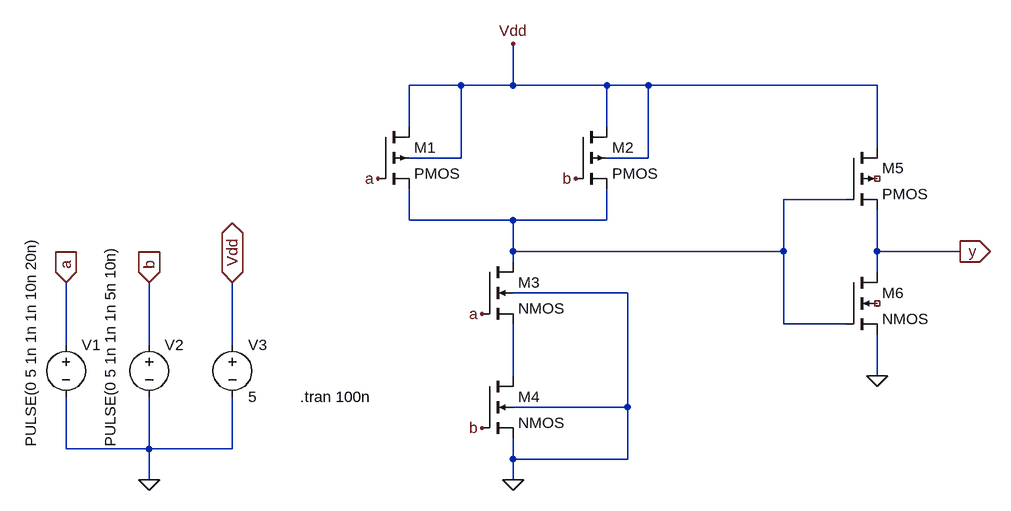
[diagram p0: schematic AND.asc]
AND.asc, the LTspice schematic file:
Version 4
SHEET 1 1628 680
WIRE 800 -112 720 -112
WIRE 880 -112 880 -176
WIRE 880 -112 800 -112
WIRE 1024 -112 880 -112
WIRE 1088 -112 1024 -112
WIRE 1440 -112 1088 -112
WIRE 720 -48 720 -112
WIRE 1024 -48 1024 -112
WIRE 1440 -16 1440 -112
WIRE 800 0 800 -112
WIRE 800 0 720 0
WIRE 1088 0 1088 -112
WIRE 1088 0 1024 0
WIRE 1392 64 1296 64
WIRE 720 96 720 48
WIRE 880 96 720 96
WIRE 1024 96 1024 48
WIRE 1024 96 880 96
WIRE 880 144 880 96
WIRE 1296 144 1296 64
WIRE 1296 144 880 144
WIRE 1440 144 1440 80
WIRE 1568 144 1440 144
WIRE 880 160 880 144
WIRE 1440 176 1440 144
WIRE 1056 208 880 208
WIRE 1296 256 1296 144
WIRE 1392 256 1296 256
WIRE 192 288 192 192
WIRE 320 288 320 192
WIRE 448 288 448 192
WIRE 880 336 880 256
WIRE 1440 336 1440 272
WIRE 1056 384 1056 208
WIRE 1056 384 880 384
WIRE 192 448 192 368
WIRE 320 448 320 368
WIRE 320 448 192 448
WIRE 448 448 448 368
WIRE 448 448 320 448
WIRE 880 464 880 432
WIRE 1056 464 1056 384
WIRE 1056 464 880 464
WIRE 320 496 320 448
WIRE 880 496 880 464
FLAG 320 496 0
FLAG 192 192 a
IOPIN 192 192 In
FLAG 320 192 b
IOPIN 320 192 In
FLAG 448 192 Vdd
IOPIN 448 192 BiDir
FLAG 880 496 0
FLAG 672 32 a
FLAG 832 240 a
FLAG 976 32 b
FLAG 832 416 b
FLAG 880 -176 Vdd
FLAG 1440 336 0
FLAG 1568 144 y
IOPIN 1568 144 Out
SYMBOL voltage 192 272 R0
WINDOW 3 -54 -151 VRight 2
SYMATTR InstName V1
SYMATTR Value PULSE(0 5 1n 1n 1n 10n 20n)
SYMBOL voltage 320 272 R0
WINDOW 3 -60 -137 VRight 2
SYMATTR InstName V2
SYMATTR Value PULSE(0 5 1n 1n 1n 5n 10n)
SYMBOL voltage 448 272 R0
SYMATTR InstName V3
SYMATTR Value 5
SYMBOL pmos4 672 -48 R0
SYMATTR InstName M1
SYMBOL pmos4 976 -48 R0
SYMATTR InstName M2
SYMBOL nmos4 832 160 R0
SYMATTR InstName M3
SYMBOL nmos4 832 336 R0
SYMATTR InstName M4
SYMBOL pmos4 1392 -16 R0
SYMATTR InstName M5
SYMBOL nmos4 1392 176 R0
SYMATTR InstName M6
TEXT 552 368 Left 2 !.tran 100n

The netlist it stands for:
* AND.asc
V1 a 0 PULSE(0 5 1n 1n 1n 10n 20n)
V2 b 0 PULSE(0 5 1n 1n 1n 5n 10n)
V3 Vdd 0 5
M1 Vdd a N001 Vdd PMOS
M2 Vdd b N001 Vdd PMOS
M3 N001 a N002 0 NMOS
M4 N002 b 0 0 NMOS
M5 Vdd N001 y NC_01 PMOS
M6 y N001 0 NC_02 NMOS
.model NMOS NMOS
.model PMOS PMOS
.lib standard.mos
.tran 100n
.backanno
.end